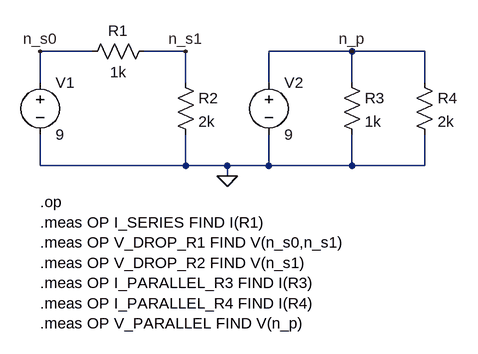
[diagram p0: schematic series_parallel_resistors.asc]
series_parallel_resistors.asc, the LTspice schematic file:
Version 4.1
SHEET 1 880 680
WIRE 144 80 64 80
WIRE 288 80 224 80
WIRE 544 80 416 80
WIRE 656 80 544 80
WIRE 64 128 64 80
WIRE 288 128 288 80
WIRE 416 128 416 80
WIRE 544 128 544 80
WIRE 656 128 656 80
WIRE 64 256 64 208
WIRE 288 256 288 208
WIRE 288 256 64 256
WIRE 352 256 288 256
WIRE 416 256 416 208
WIRE 416 256 352 256
WIRE 544 256 544 208
WIRE 544 256 416 256
WIRE 656 256 656 208
WIRE 656 256 544 256
WIRE 352 272 352 256
FLAG 64 80 n_s0
FLAG 288 80 n_s1
FLAG 352 272 0
FLAG 544 80 n_p
SYMBOL voltage 64 112 R0
WINDOW 123 0 0 Left 0
WINDOW 39 0 0 Left 0
SYMATTR InstName V1
SYMATTR Value 9
SYMBOL res 128 96 R270
WINDOW 0 32 56 VTop 2
WINDOW 3 0 56 VBottom 2
SYMATTR InstName R1
SYMATTR Value 1k
SYMBOL res 272 112 R0
SYMATTR InstName R2
SYMATTR Value 2k
SYMBOL voltage 416 112 R0
WINDOW 123 0 0 Left 0
WINDOW 39 0 0 Left 0
SYMATTR InstName V2
SYMATTR Value 9
SYMBOL res 528 112 R0
SYMATTR InstName R3
SYMATTR Value 1k
SYMBOL res 640 112 R0
SYMATTR InstName R4
SYMATTR Value 2k
TEXT 64 312 Left 2 !.op\n.meas OP I_SERIES FIND I(R1)\n.meas OP V_DROP_R1 FIND V(n_s0,n_s1)\n.meas OP V_DROP_R2 FIND V(n_s1)\n.meas OP I_PARALLEL_R3 FIND I(R3)\n.meas OP I_PARALLEL_R4 FIND I(R4)\n.meas OP V_PARALLEL FIND V(n_p)

The netlist it stands for:
* series_parallel_resistors.asc
V1 n_s0 0 9
R1 n_s0 n_s1 1k
R2 n_s1 0 2k
V2 n_p 0 9
R3 n_p 0 1k
R4 n_p 0 2k
.op
.meas OP I_SERIES FIND I(R1)
.meas OP V_DROP_R1 FIND V(n_s0,n_s1)
.meas OP V_DROP_R2 FIND V(n_s1)
.meas OP I_PARALLEL_R3 FIND I(R3)
.meas OP I_PARALLEL_R4 FIND I(R4)
.meas OP V_PARALLEL FIND V(n_p)
.backanno
.end